# Altium schematic sheet OPTIC.SchDoc
size A3; SheetNumber: 2; SheetTotal: 3
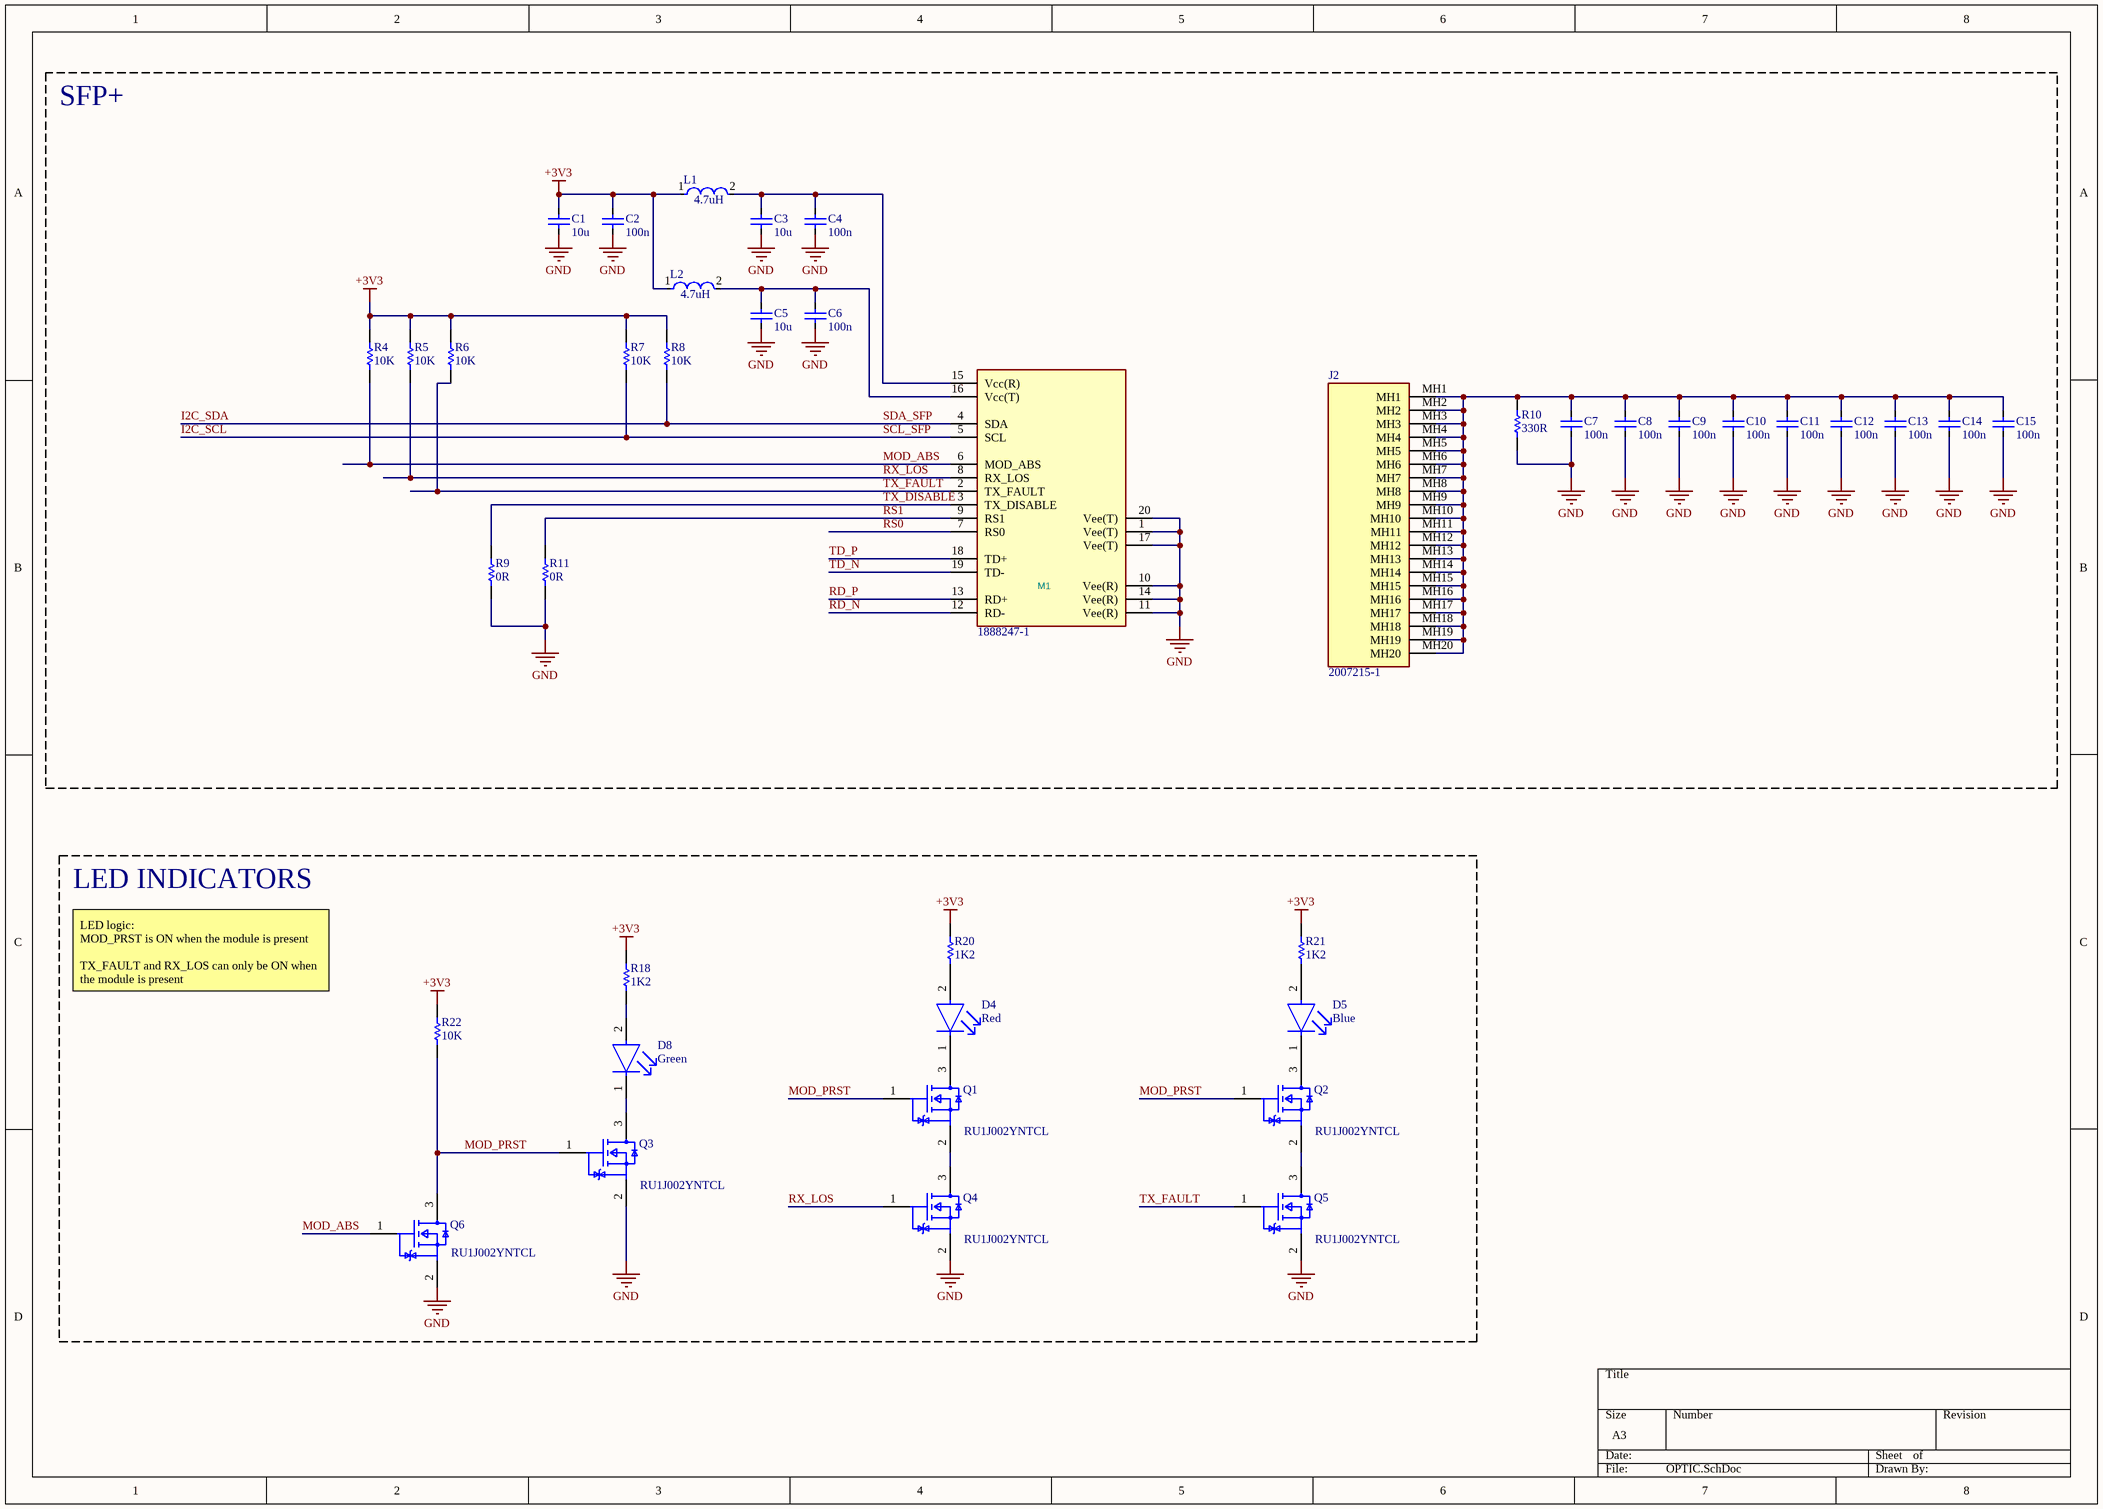
[diagram p0: OPTIC.SchDoc]

## Parts
C1  value 10u  [FP-C1608-080-0_1-IPC_C]  (hidden comment: C1608JB0J106K080AB)
C2  value 100n  [FP-C1005-050-0_05-IPC_C]  (hidden comment: C1005X7R1H104K050BB)
C3  value 10u  [FP-C1608-080-0_1-IPC_C]  (hidden comment: C1608JB0J106K080AB)
C4  value 100n  [FP-C1005-050-0_05-IPC_C]  (hidden comment: C1005X7R1H104K050BB)
C5  value 10u  [FP-C1608-080-0_1-IPC_C]  (hidden comment: C1608JB0J106K080AB)
C6  value 100n  [FP-C1005-050-0_05-IPC_C]  (hidden comment: C1005X7R1H104K050BB)
C7  value 100n  [FP-C1005-050-0_05-IPC_C]  (hidden comment: C1005X7R1H104K050BB)
C8  value 100n  [FP-C1005-050-0_05-IPC_C]  (hidden comment: C1005X7R1H104K050BB)
C9  value 100n  [FP-C1005-050-0_05-IPC_C]  (hidden comment: C1005X7R1H104K050BB)
C10  value 100n  [FP-C1005-050-0_05-IPC_C]  (hidden comment: C1005X7R1H104K050BB)
C11  value 100n  [FP-C1005-050-0_05-IPC_C]  (hidden comment: C1005X7R1H104K050BB)
C12  value 100n  [FP-C1005-050-0_05-IPC_C]  (hidden comment: C1005X7R1H104K050BB)
C13  value 100n  [FP-C1005-050-0_05-IPC_C]  (hidden comment: C1005X7R1H104K050BB)
C14  value 100n  [FP-C1005-050-0_05-IPC_C]  (hidden comment: C1005X7R1H104K050BB)
C15  value 100n  [FP-C1005-050-0_05-IPC_C]  (hidden comment: C1005X7R1H104K050BB)
D4  Color: Red  [FP-LTST-C191KRKT-MFG]  (hidden comment: LTST-C191KRKT)
D5  Color: Blue  [FP-LTST-C191TBKT-MFG]  (hidden comment: LTST-C191TBKT)
D8  Color: Green  [FP-LTST-C191GKT-MFG]  (hidden comment: LTST-C191GKT)
J2  2007215-1  [2007215-1]
L1  Inductance: 4.7uH  [FP-DFE252012C-IPC_C]  (hidden comment: DFE252012P-4R7M=P2)
L2  Inductance: 4.7uH  [FP-DFE252012C-IPC_C]  (hidden comment: DFE252012P-4R7M=P2)
M1  1888247-1  [1888247-1]
Q1  RU1J002YNTCL  [FP-UMT3F-MFG]
Q2  RU1J002YNTCL  [FP-UMT3F-MFG]
Q3  RU1J002YNTCL  [FP-UMT3F-MFG]
Q4  RU1J002YNTCL  [FP-UMT3F-MFG]
Q5  RU1J002YNTCL  [FP-UMT3F-MFG]
Q6  RU1J002YNTCL  [FP-UMT3F-MFG]
R4  value 10K  [RESC1005X40X25LL05T10]  (hidden comment: RC0402FR-0710KL)
R5  value 10K  [RESC1005X40X25LL05T10]  (hidden comment: RC0402FR-0710KL)
R6  value 10K  [RESC1005X40X25LL05T10]  (hidden comment: RC0402FR-0710KL)
R7  value 10K  [RESC1005X40X25LL05T10]  (hidden comment: RC0402FR-0710KL)
R8  value 10K  [RESC1005X40X25LL05T10]  (hidden comment: RC0402FR-0710KL)
R9  value 0R  [RESC1005X40X25LL05T10]  (hidden comment: RC0402FR-070RL)
R10  value 330R  [RESC1005X40X25LL05T10]  (hidden comment: RC0402FR-07330RL)
R11  value 0R  [RESC1005X40X25LL05T10]  (hidden comment: RC0402FR-070RL)
R18  value 1K2  [RESC1005X40X25ML05T10]  (hidden comment: RC0402FR-071K2L)
R20  value 1K2  [RESC1005X40X25ML05T10]  (hidden comment: RC0402FR-071K2L)
R21  value 1K2  [RESC1005X40X25ML05T10]  (hidden comment: RC0402FR-071K2L)
R22  value 10K  [RESC1005X40X25LL05T10]  (hidden comment: RC0402FR-0710KL)

## Blocks framed on the sheet
SFP+: C1-C15 J2 L1 L2 M1 R4-R11
LED INDICATORS: D4 D5 D8 Q1-Q6 R18 R20-R22

## Nets
+3V3: C1.1 C2.1 L1.1 L2.1 R4.1 R5.1 R6.1 R7.1 R8.1 R18.1 R20.1 R21.1 R22.1
GND: C1.2 C2.2 C3.2 C4.2 C5.2 C6.2 C7.2 C8.2 C9.2 C10.2 C11.2 C12.2 C13.2 C14.2 C15.2 M1.1(Vee(T)) M1.10(Vee(R)) M1.11(Vee(R)) M1.14(Vee(R)) M1.17(Vee(T)) M1.20(Vee(T)) Q3.2(S) Q4.2(S) Q5.2(S) Q6.2(S) R9.2 R10.2 R11.2
I2C_SCL: M1.5(SCL) R7.2  [also labelled SCL_SFP]
I2C_SDA: M1.4(SDA) R8.2  [also labelled SDA_SFP]
MOD_ABS: M1.6(MOD_ABS) Q6.1(G) R4.2
MOD_PRST: Q1.1(G) Q2.1(G) Q3.1(G) Q6.3(D) R22.2
RD_N: M1.12(RD-)
RD_P: M1.13(RD+)
RS0: M1.7(RS0)
RS1: M1.9(RS1) R11.1
RX_LOS: M1.8(RX_LOS) Q4.1(G) R5.2
TD_N: M1.19(TD-)
TD_P: M1.18(TD+)
TX_DISABLE: M1.3(TX_DISABLE) R9.1
TX_FAULT: M1.2(TX_FAULT) Q5.1(G) R6.2
NetC3_1: C3.1 C4.1 L1.2 M1.15(Vcc(R))
NetC5_1: C5.1 C6.1 L2.2 M1.16(Vcc(T))
NetC7_1: C7.1 C8.1 C9.1 C10.1 C11.1 C12.1 C13.1 C14.1 C15.1 J2.MH1 J2.MH2 J2.MH3 J2.MH4 J2.MH5 J2.MH6 J2.MH7 J2.MH8 J2.MH9 J2.MH10 J2.MH11 J2.MH12 J2.MH13 J2.MH14 J2.MH15 J2.MH16 J2.MH17 J2.MH18 J2.MH19 J2.MH20 R10.1
NetD4_1: D4.1(C) Q1.3(D)
NetD4_2: D4.2(A) R20.2
NetD5_1: D5.1(C) Q2.3(D)
NetD5_2: D5.2(A) R21.2
NetD8_1: D8.1(C) Q3.3(D)
NetD8_2: D8.2(A) R18.2
NetQ1_2: Q1.2(S) Q4.3(D)
NetQ2_2: Q2.2(S) Q5.3(D)

## Notes on the sheet
- LED logic:
  MOD_PRST is ON when the module is present
  TX_FAULT and RX_LOS can only be ON when the module is present

## Library data of the parts
C1 C3 C5 = C1608JB0J106K080AB: MLCC 10μF ±10% 6.3V JB SMD 0603; Dielectric Material: Ceramic; Case Code (Imperial): 0603; Thickness: 0.035inch; Min Operating Temperature: -25°C; Termination: SMD/SMT; Lead Free: Lead Free; Resistor Type: Ceramic; Width: 0.8mm; Voltage Rating (DC): 6.3V; Package Quantity: 4000; Tolerance: 10%; Length: 0.063inch; Series: C; Height: 0.8mm; Max Operating Temperature: 85°C; Mount: Surface Mount; RoHS Compliant: Yes; Voltage Rating: 6.3V; Case Code (Metric): 1608; Case/Package: 0603; Packaging: Tape and Reel
C2 C4 C6-C15 = C1005X7R1H104K050BB: MLCC 100nF ±10% 50V X7R SMD 0402; Dielectric Material: Ceramic; Voltage: 50V; Min Operating Temperature: -55°C; Depth: 0.5mm; Radiation Hardening: No; RoHS Compliant: Yes; Voltage Rating (DC): 50V; Lead Free: Lead Free; Resistor Type: Ceramic; Height: 0.5mm; Dielectric: X7R; Thickness: 0.022inch; Case/Package: 0402; Case Code (Metric): 1005; Termination: SMD/SMT; Packaging: Tape and Reel; Max Operating Temperature: 125°C; Mount: Surface Mount; Package Quantity: 1; Width: 0.02inch; Weight: 2.3E-05oz; Voltage Rating: 50V; Tolerance: 10%; Construction: Flat; Case Code (Imperial): 0402; Length: 1mm; REACH SVHC: No SVHC; Series: C; Part Number: C1005X7R1H104K050BB
D4 = CMP-2000-05199-2: NexarPartId: 549908; Lens Transparency: Clear; Luminous Intensity: 54mcd; Current: 2A; Forward Current: 20mA; Number of Elements: 1; Power Rating: 75mW; Lens Color: Colorless; Wavelength: 639nm; Viewing Angle: 130°; Voltage: 2V; Dominant Wavelength: 631nm; Reverse Voltage: 5V; Illumination Color: Red; Height: 550µm; Length: 1.6mm; Number of Pins: 2; Packaging: Tape and Reel; Mount: Surface Mount; Case Code (Metric): 1608; Radiation Hardening: No; Case Code (Imperial): 0603; Test Current: 20mA; Number of LEDs: 1; Schedule B: 8541402000, 8541402000; Lead Free: Lead Free; Power Dissipation: 75mW; RoHS: Compliant; Forward Voltage: 2V; Lens Style: Clear; Max Operating Temperature: 85°C; Depth: 800µm; Width: 800µm; Min Operating Temperature: -55°C; Case/Package: 0603
D5 = CMP-22017-000008-1: LED BLUE CLEAR CHIP SMD; Lens Color: Colorless; Dominant Wavelength: 475nm; Forward Current: 20mA; Wavelength: 468nm; Viewing Angle: 130°; Power Dissipation: 76mW; Luminous Intensity: 180mcd; Reverse Voltage: 5V; Number of Elements: 1; Lens Style: Diffused; Forward Voltage: 3.8V; Max Power Dissipation: 75mW; Case Code (Metric): 1608; Packaging: Tape and Reel; Case/Package: 0603; Depth: 1.6mm; Mount: Surface Mount; Lead Free: Lead Free; Min Operating Temperature: -20°C; Lens Transparency: Clear; Illumination Color: Blue; Height: 0.55mm; Test Current: 20mA; Case Code (Imperial): 0603; Max Operating Temperature: 80°C; Number of Pins: 2; Length: 0.8mm; Radiation Hardening: No; Package Quantity: 1; Number of LEDs: 1; Width: 0.8mm
D8 = CMP-22017-000029-1: LED GREEN CLEAR CHIP SMD; Power Dissipation: 100mW; Lens Color: Colorless; Number of Elements: 1; Dominant Wavelength: 569nm; Forward Voltage: 2.1V; Forward Current: 30mA; Test Current: 20mA; Viewing Angle: 130°; Wavelength: 565nm; Luminous Intensity: 12mcd; Reverse Voltage: 5V; Case/Package: 0603; Package Quantity: 1; Illumination Color: Green; Lens Style: Clear; Lens Transparency: Clear; Depth: 0.8mm; Power Rating: 100mW; Width: 0.8mm; Height: 0.55mm; Radiation Hardening: No; Case Code (Imperial): 0603; Number of Pins: 2; Length: 1.6mm; Case Code (Metric): 1608; Max Operating Temperature: 85°C; Packaging: Tape and Reel; Mount: Surface Mount; Min Operating Temperature: -55°C; Lead Free: Lead Free; Number of LEDs: 1
J2 = 2007215-1: Position SFP+ Cage Connector Press-Fit Through Hole
L1 L2 = CMP-06042-011776-1: Shielded Wirewound Inductor 4.7uH 20% 1400mA 0.2Ω 1008 (2520); Core Material: Ferrite; Test Frequency: 1MHz; DC Resistance (DCR): 200mR; Max DC Current: 1.4A; Current Rating: 2A; Case Code (Metric): 2520; Case Code (Imperial): 1008; Mount: Surface Mount; Packaging: Tape and Reel; Depth: 2mm; Length: 0.098inch; Case/Package: 1008; Max Operating Temperature: 125°C; Shielding: Shielded; Width: 0.079inch; Height - Seated (Max): 0.047inch; Tolerance: 20%; Min Operating Temperature: -40°C; Resistor Type: Wirewound
M1 = 1888247-1: SFP+, Connector, .8mm [.031in] Centerline, Power & Signal, Operating Temperature Range -55 – 85 °C [-67 – 185 °F], Data Rate (Max) 16Gb/sec; Manufacturer: TE Connectivity (TE; License: Apache-2.0; Author: Parsa Malekpor; Value: 1888247-1; Part Number: 1888247-1
Q1-Q6 = RU1J002YNTCL: MOSFET N-CH 50V 0.2A UMT3F; Manufacturer: Rohm; Drain To Source Resistance: 1.6Ω; Depletion Mode: False; Continuous Drain Current: 200mA; Pulse Drain Current: 800mA; Turn On Delay Time: 5ns; Threshold Vgs Max: 0.8V; Rthja Max: 833°C/W; Max Forward Diode Voltage: 1.2V; Max Junction Temp: +150°C; Standoff Height: 0mm; Input Capacitace At Vds: 26pF @ 10V; Number Of Channels: 1; Power Dissipation: 150mW; Gate To Source Voltage: 8V; Turn Off Delay Time: 17ns; Threshold Vgs Min: 0.3V; Lead Free: Yes; Device Class L3: MOSFETs; Drain To Source Voltage: 50V; ComponentLink2URL: https://d1d2qsbl8m0m72.cloudfront.net/en/products/databook/datasheet/discrete/transistor/mosfet/ru1j002yn-e.pdf; RoHS: TRUE; Device Class L2: Transistors; Mouser Description: MOSFET 0.9V Drive Nch MOSFET; Category: Trans; Octopart: https://octopart.com/ru1j002yntcl-rohm-47197697; Temperature: to +150°C; Height: 1.05mm; Number Of N Channels: 1; Package: UMT3F; ComponentLink2Description: Datasheet; Automotive: No; Drain To Source Breakdown Voltage: 50V; Device Class L1: Discrete Semiconductors; Digikey Description: MOSFET N-CH 50V 0.2A UMT3F; Manufacturer Part Number: RU1J002YNTCL; Temperature Range High: +150°C
R4-R9 R11 R22 = CMP-2002-07353-1: Manufacturer: Yageo / Phycomp
  R4-R8 R22: Part Number: RC0402FR-0710KL
  R9 R11: Part Number: RC0402FR-070RL
R10 = CMP-2002-07613-1: Manufacturer: Yageo / Phycomp; Part Number: RC0402FR-07330RL
R18 R20 R21 = CMP-2002-07456-1: Manufacturer: Yageo / Phycomp; Part Number: RC0402FR-071K2L